# EAGLE design flight controller initial (EAGLE 9.3.2)
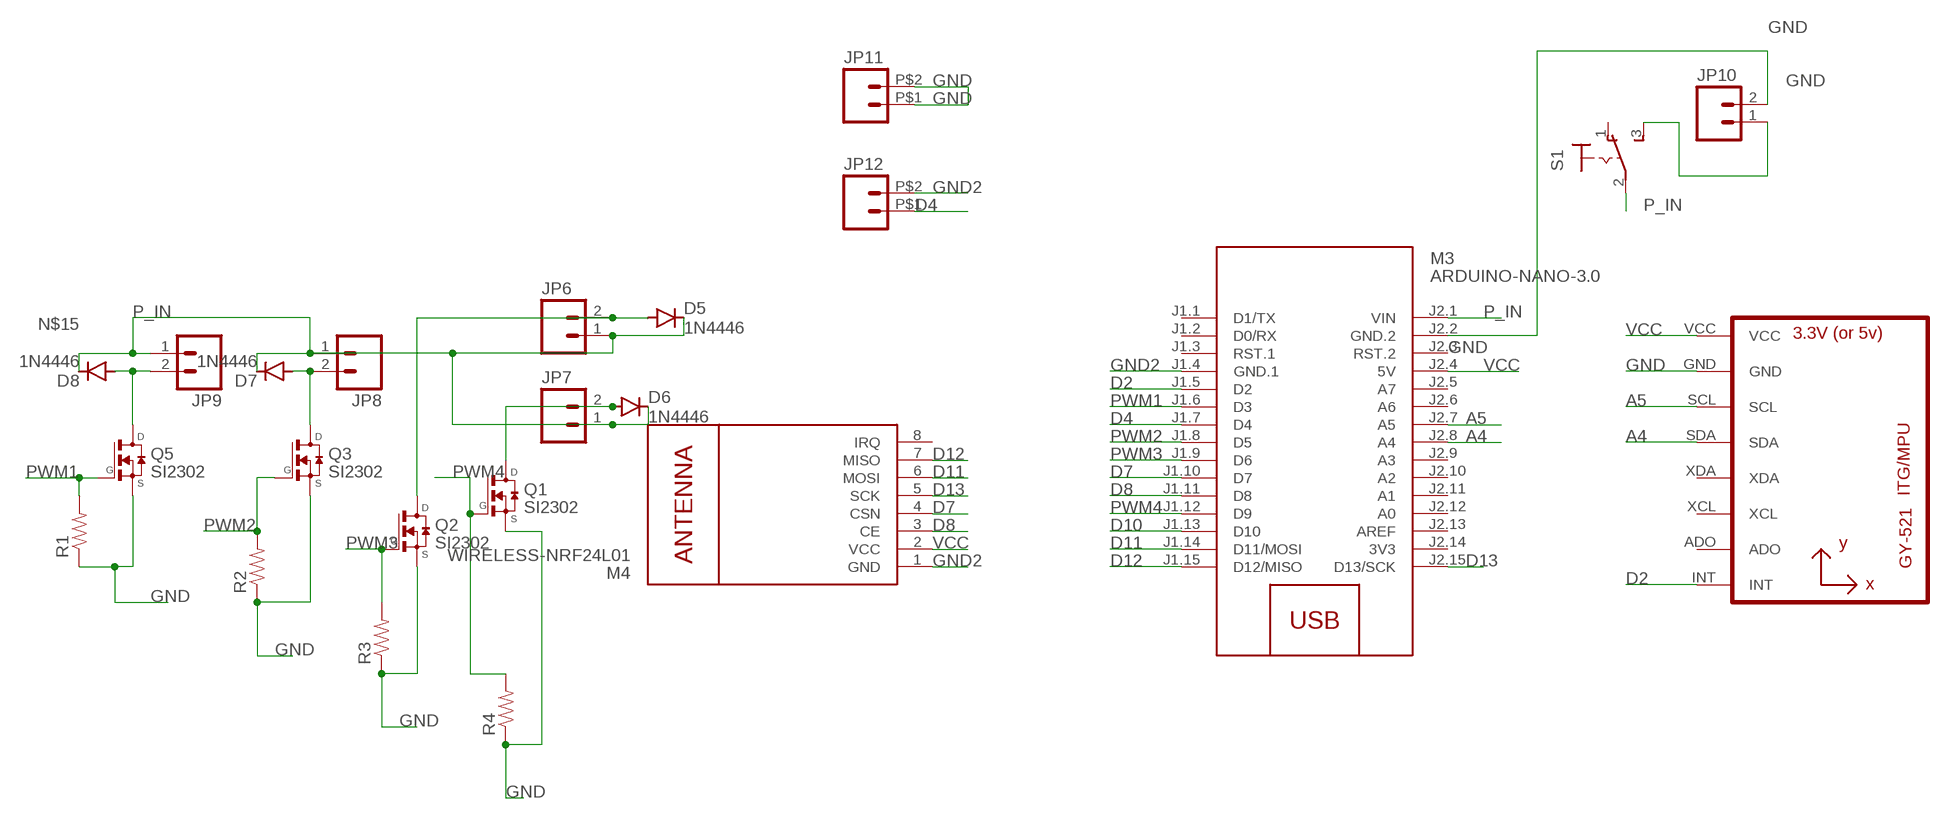
[diagram p0: schematic, sheet 1]

## Parts
D5  1N4446  [DO35-10]
D6  1N4446  [DO35-10]
D7  1N4446  [DO35-10]
D8  1N4446  [DO35-10]
JP6  M021X02_NO_SILK  [1X02_NO_SILK]
JP7  M021X02_NO_SILK  [1X02_NO_SILK]
JP8  M021X02_NO_SILK  [1X02_NO_SILK]
JP9  M021X02_NO_SILK  [1X02_NO_SILK]
JP10  M02PTH  [1X02]
JP11  M02PTH2  [1X02_BIG]
JP12  M02PTH2  [1X02_BIG]
M3  ARDUINO-NANO-3.0  [ARDUINO-NANO-3.0]
M4  WIRELESS-NRF24L01  [WIRELESS-NRF24L01]
Q1  SI2302  [SOT23]
Q2  SI2302  [SOT23]
Q3  SI2302  [SOT23]
Q5  SI2302  [SOT23]
R1  RESISTORAXIAL-0.3  [AXIAL-0.3]
R2  RESISTORAXIAL-0.3  [AXIAL-0.3]
R3  RESISTORAXIAL-0.3  [AXIAL-0.3]
R4  RESISTORAXIAL-0.3  [AXIAL-0.3]
S1  M9040P  [M9040P]
U2  GY-521MPU6050  [GY-521]

## Nets
A4: M3.J2.8(A4) U2.SDA
A5: M3.J2.7(A5) U2.SCL
D2: M3.J1.5(D2) U2.INT
D4: JP12.P$1 M3.J1.7(D4)
D7: M3.J1.10(D7) M4.4(CSN)
D8: M3.J1.11(D8) M4.3(CE)
D10: M3.J1.13(D10)
D11: M3.J1.14(D11/MOSI) M4.6(MOSI)
D12: M3.J1.15(D12/MISO) M4.7(MISO)
D13: M3.J2.15(D13/SCK) M4.5(SCK)
GND: JP10.2 JP11.P$1 JP11.P$2 M3.J2.2(GND.2) Q1.2(S) Q2.2(S) Q3.2(S) Q5.2(S) R1.P$1 R2.P$1 R3.P$1 R4.P$1 U2.GND
GND2: JP12.P$2 M3.J1.4(GND.1) M4.1(GND)
N$2: D6.A JP7.2 Q1.3(D)
N$15: D8.A JP9.2 Q5.3(D)
N$21: D5.A JP6.2 Q2.3(D)
N$24: D7.A JP8.2 Q3.3(D)
N$30: JP10.1 S1.3(S)
P_IN: D5.C D6.C D7.C D8.C JP6.1 JP7.1 JP8.1 JP9.1 M3.J2.1(VIN) S1.2(P)
PWM1: M3.J1.6(D3) Q5.1(G) R1.P$2
PWM2: M3.J1.8(D5) Q3.1(G) R2.P$2
PWM3: M3.J1.9(D6) Q2.1(G) R3.P$2
PWM4: M3.J1.12(D9) Q1.1(G) R4.P$2
VCC: M3.J2.4(5V) M4.2(VCC) U2.VCC
Unconnected: M3.J1.1(D1/TX) M3.J1.2(D0/RX) M3.J1.3(RST.1) M3.J2.3(RST.2) M3.J2.5(A7) M3.J2.6(A6) M3.J2.9(A3) M3.J2.10(A2) M3.J2.11(A1) M3.J2.12(A0) M3.J2.13(AREF) M4.8(IRQ) S1.1(O) U2.ADO U2.XCL U2.XDA

## Power pins joined to a net without a drawn wire
3V3: M3.J2.14(3V3)

## Library data of the parts
D5-D8 = diode:1N4446: DIODE high speed (Philips)
JP6-JP12 = SparkFun:M02: Header 2 Standard 2-pin 0.1" header. Use with straight break away headers (SKU : PRT-00116), right angle break away headers (PRT-00553), swiss pins (PRT-00743), machine pins (PRT-00117), and female headers (PRT-00115). Molex polarized connector foot print use with SKU : PRT-08233 with associated crimp pins and housings.
M3 = diy-modules:ARDUINO-NANO-3.0: Arduino Nano 3.0 and compatible devices More details available here: https://www.arduino.cc/en/Main/ArduinoBoardNano Click here to find device on ebay.com <http://www.ebay.com/sch/arduino+nano>
M4 = diy-modules:WIRELESS-NRF24L01: 2.4 GHz Wireless Module based on NRF24L01 chip More details available here: http://www.electrodragon.com/w/NRF24L01 Click here to find device on ebay.com <http://www.ebay.com/sch/nrf24l01+arduino>
Q1-Q3 Q5 = transistor-fet:SI2302: MOSFET N-Channel 20 V (D-S)
R1-R4 = SparkFun:RESISTOR: Resistor Basic schematic elements and footprints for 0603, 1206, and PTH resistors.
S1 = switch:M9040P: TOGGLE SWITCH Marquardt
U2 = gy-521:GY-521

## Board
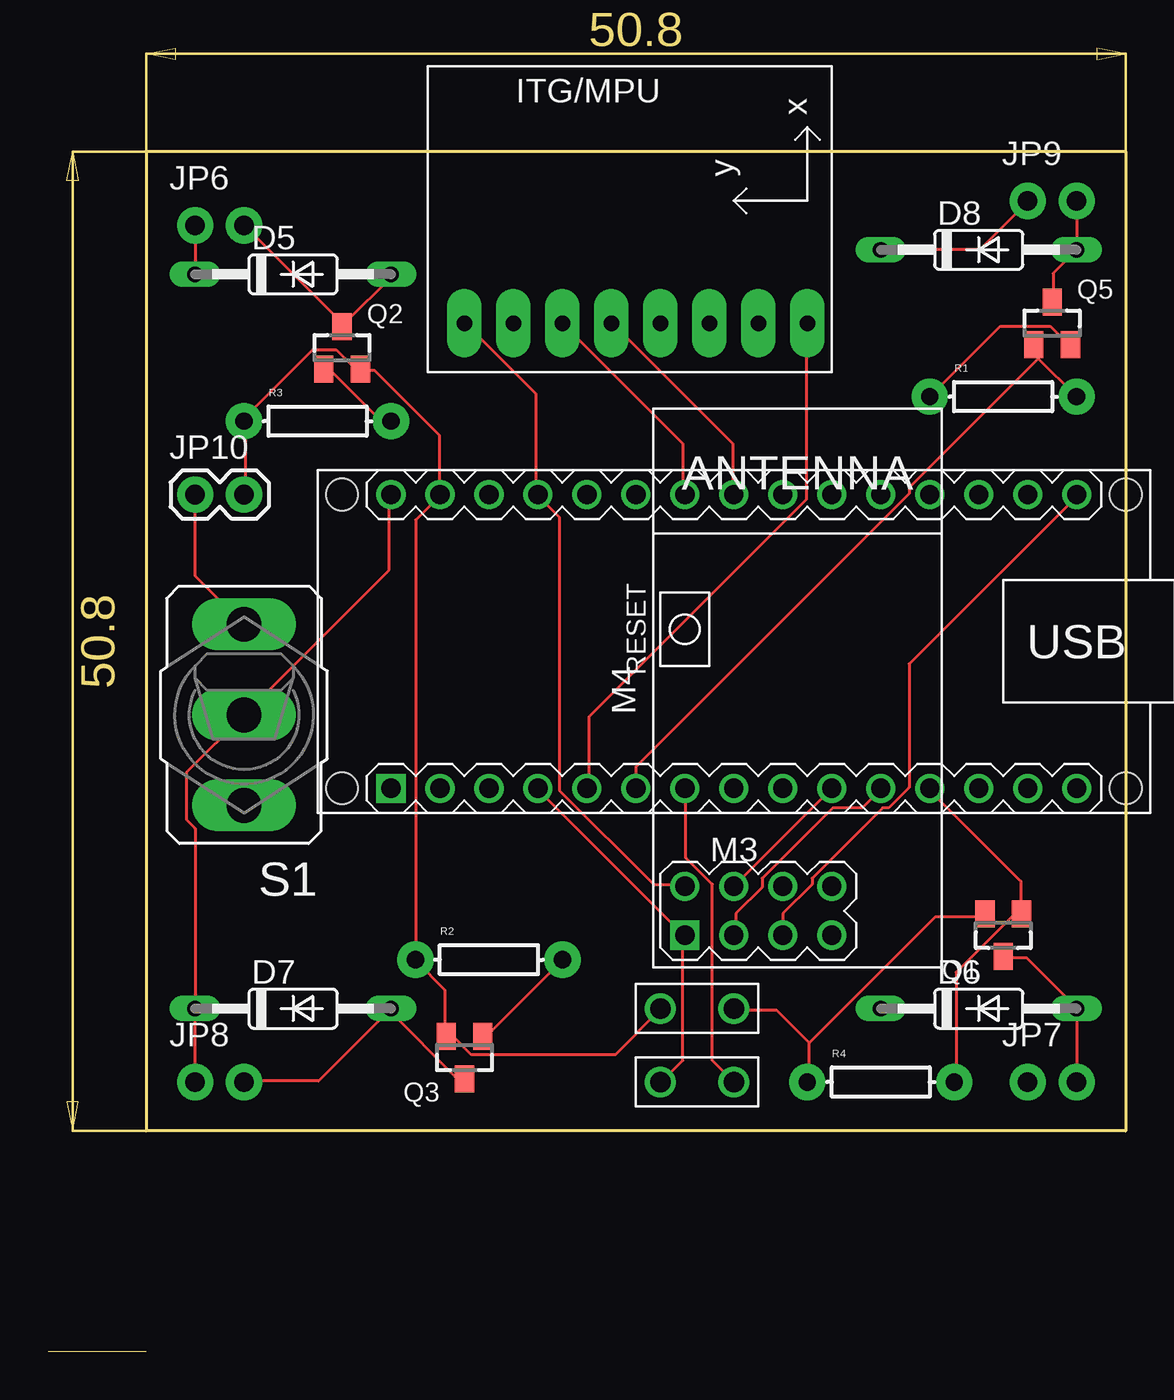
[diagram p1: board, top side]
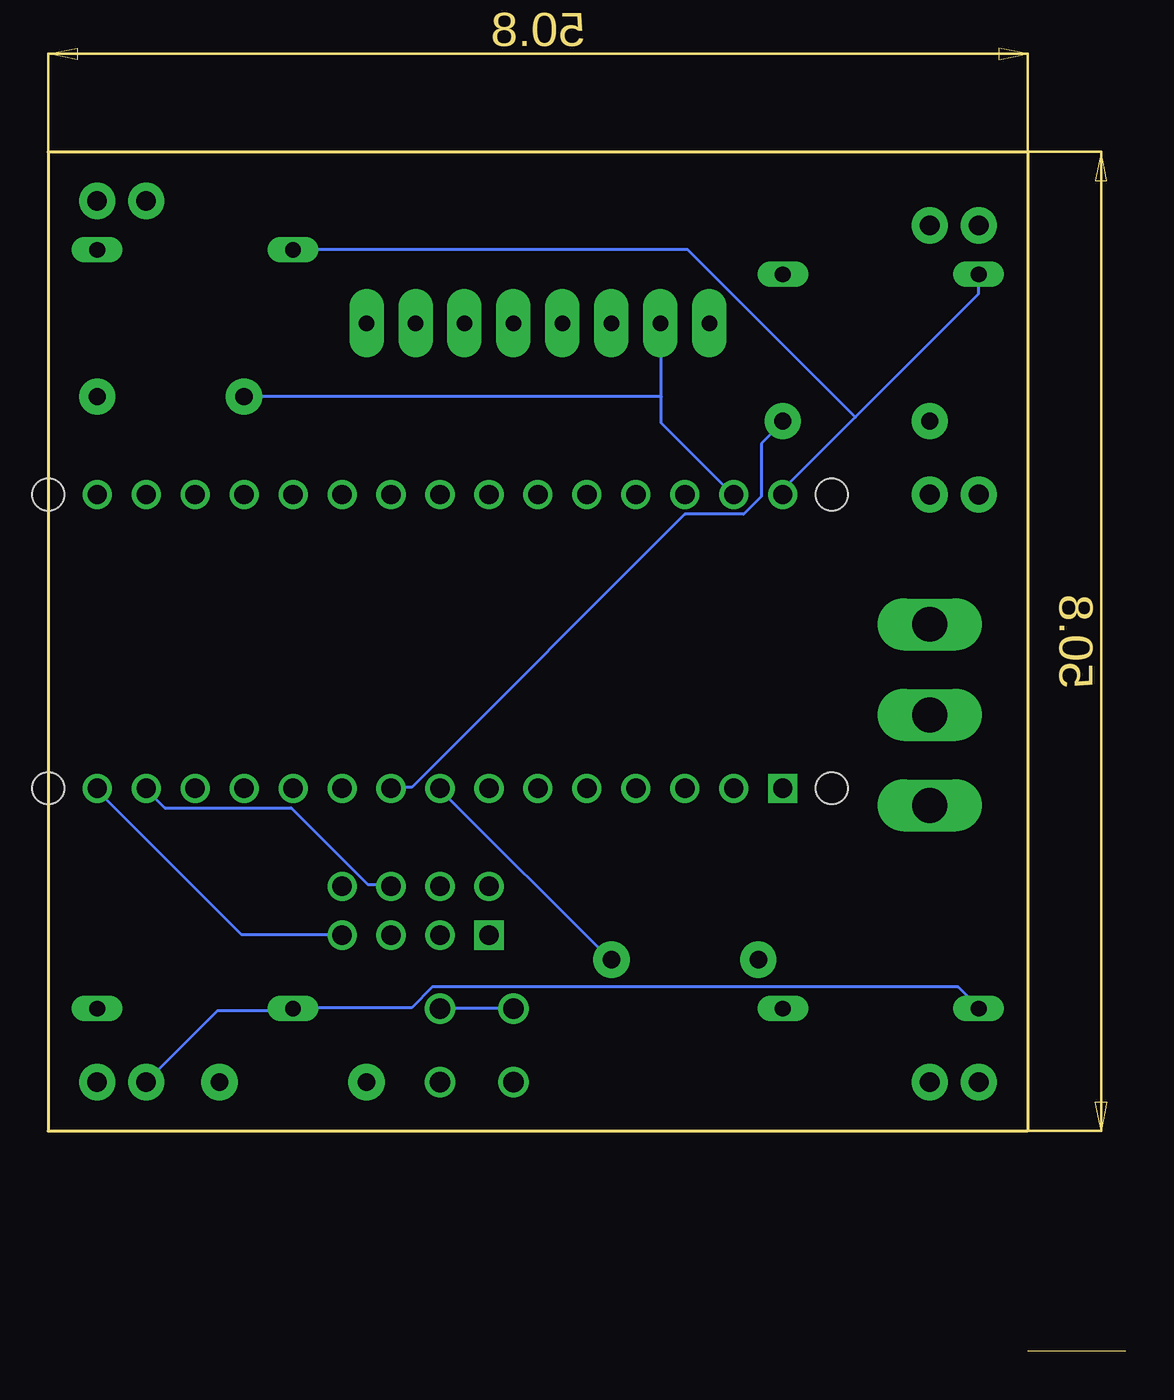
[diagram p2: board, bottom side, seen from below]

Size 55.88 x 62.23 mm. Coordinates in mm from the lower left corner, seen from the top.
Outline: 0,0 5.08,0
Outline: 5.08,62.23 5.08,11.43 55.88,11.43 55.88,62.23 5.08,62.23
Copper layers (1*16): Top 0.035mm / dielectric 1.5mm / Bottom 0.035mm
Design rules "default": minimum track width 6mil, minimum drill 0.35mm, track to track 6mil, track to pad 6mil, pad to pad 6mil, via to via 6mil, smd to smd 6mil, copper to edge 40mil, drill to drill 6mil, minimum pad ring 10mil, minimum via ring 8mil, stop-mask expansion 4mil, vias tented up to drill 0mil, thermal gap 10mil

### Footprints (pad centres in the part's own frame; a part is rotated, then mirrored left to right if it is on the bottom)
DO35-10 = drill 0.813 long: A 5.08,0; C -5.08,0
1X02_NO_SILK = drill 1.016 pad 1.88: 1 0,0; 2 2.54,0
1X02 = drill 1.016 pad 1.88: 1 0,0; 2 2.54,0
1X02_BIG = drill 1.067: P$1 0,0; P$2 3.81,0
ARDUINO-NANO-3.0 = drill 1 square: J1.1 17.78,7.62 | drill 1: J1.2 15.24,7.62; J1.3 12.7,7.62; J1.4 10.16,7.62; J1.5 7.62,7.62; J1.6 5.08,7.62; J1.7 2.54,7.62; J1.8 0,7.62; J1.9 -2.54,7.62; J1.10 -5.08,7.62; J1.11 -7.62,7.62; J1.12 -10.16,7.62; J1.13 -12.7,7.62; J1.14 -15.24,7.62; J1.15 -17.78,7.62; J2.1 17.78,-7.62; J2.2 15.24,-7.62; J2.3 12.7,-7.62; J2.4 10.16,-7.62; J2.5 7.62,-7.62; J2.6 5.08,-7.62; J2.7 2.54,-7.62; J2.8 0,-7.62; J2.9 -2.54,-7.62; J2.10 -5.08,-7.62; J2.11 -7.62,-7.62; J2.12 -10.16,-7.62; J2.13 -12.7,-7.62; J2.14 -15.24,-7.62; J2.15 -17.78,-7.62 | hole 1.651: -20.32,7.62; -20.32,-7.62; 20.32,-7.62; 20.32,7.62
WIRELESS-NRF24L01 = drill 1 square: 1 -12.7,6.35 | drill 1: 2 -10.16,6.35; 3 -12.7,3.81; 4 -10.16,3.81; 5 -12.7,1.27; 6 -10.16,1.27; 7 -12.7,-1.27; 8 -10.16,-1.27
SOT23 = smd 1 x 1.4: 1 -0.95,-1.1; 2 0.95,-1.1; 3 0,1.1
AXIAL-0.3 = drill 0.9 pad 1.88: P$1 -3.81,0; P$2 3.81,0
M9040P = drill 1.803 long: 1 0,4.699; 2 0,0; 3 0,-4.699
GY-521 = drill 0.8 pad 1.778 long: ADO -8.89,-6.35; GND -8.89,6.35; INT -8.89,-8.89; SCL -8.89,3.81; SDA -8.89,1.27; VCC -8.89,8.89; XCL -8.89,-3.81; XDA -8.89,-1.27

### Placement (x,y rotation side)
D5  12.7,55.88 0 top
D6  48.26,17.78 0 top
D7  12.7,17.78 0 top
D8  48.26,57.15 0 top
JP6  7.62,58.42 0 top
JP7  50.8,13.97 0 top
JP8  7.62,13.97 0 top
JP9  50.8,59.69 0 top
JP10  7.62,44.45 0 top
JP11  31.75,17.78 0 top
JP12  35.56,13.97 180 top
M3  35.56,36.83 180 top
M4  39.37,34.29 90 top
Q1  49.53,21.59 180 top
Q2  15.24,52.07 0 top
Q3  21.59,15.24 180 top
Q5  52.07,53.34 0 top
R1  49.53,49.53 0 top
R2  22.86,20.32 0 top
R3  13.97,48.26 0 top
R4  43.18,13.97 0 top
S1  10.16,33.02 180 top
U2  30.48,62.23 90 top

### Tracks (layer width: path | path; a pad name or v marks a point on that pad's centre or on a via)
A4
  Top 0.152: M3.J2.8 35.51,44.5 35.51,47.09 29.26,53.34 U2.SDA
A5
  Top 0.152: U2.SCL 32.92,47.09 32.92,44.5 M3.J2.7
D2
  Top 0.152: M3.J1.5 28.04,29.26 28.04,32.92 39.32,44.2 39.32,53.34 U2.INT
D4
  Top 0.152: JP12.P$1 34.44,15.09 34.44,24.23 33.07,25.6 33.07,29.11 M3.J1.7
D7
  Top 0.152: M3.J1.10 M4.4
D8
  Top 0.152: M4.3 35.66,21.64 35.66,22.71 37.03,24.08 37.03,24.54 40.69,28.19 42.22,28.19 43.13,29.11 M3.J1.11
D11
  Bottom 0.152: M4.6 38.1,24.23 39.32,24.23 43.28,28.19 49.84,28.19 50.75,29.11 M3.J1.14
D12
  Bottom 0.152: M4.7 40.69,21.64 45.87,21.64 53.34,29.11 M3.J1.15
D13
  Top 0.152: M4.5 38.1,22.71 39.62,24.23 39.62,24.54 43.28,28.19 43.59,28.19 44.65,29.26 44.65,35.66 53.34,44.35 M3.J2.15
GND
  Top 0.152: 39.47,16 46.02,22.55 48.46,22.55 Q1.2 | 39.47,16 39.47,14.02 R4.P$1 | 39.47,16 37.8,17.68 35.66,17.68 JP11.P$2 | JP11.P$1 31.7,17.68 29.41,15.39 21.95,15.39 21.03,16.31 20.73,16.31 Q3.2 20.57,16.46 20.57,18.75 19.05,20.27 R2.P$1 19.05,43.13 20.27,44.35 M3.J2.2 20.27,44.5 20.27,47.55 16.92,50.9 16.31,50.9 Q2.2 16.15,51.05 15.85,51.05 14.94,51.97 13.72,51.97 10.06,48.31 R3.P$1 10.21,48.16 10.21,44.5 JP10.2 | R1.P$1 49.38,53.19 51.97,53.19 52.88,52.27 Q5.2
  Bottom 0.152: JP11.P$1 31.85,17.83 35.51,17.83 JP11.P$2 | 24.08,49.53 24.08,48.16 20.42,44.5 M3.J2.2 | 24.08,49.53 24.08,53.34 U2.GND | 24.08,49.53 R1.P$1
GND2
  Top 0.152: JP12.P$2 31.85,14.02 32.92,15.09 32.92,21.49 M4.1 32.92,21.64 25.45,29.11 M3.J1.4
N$2
  Top 0.152: Q1.3 49.53,20.42 50.75,20.42 53.34,17.83 D6.A JP7.2
N$15
  Top 0.152: Q5.3 52.12,54.56 52.12,55.93 D8.A JP9.2
N$21
  Top 0.152: 15.39,53.34 17.83,55.78 D5.A | 15.39,53.34 15.24,53.19 Q2.3 15.39,53.34 | JP6.2 15.24,53.34 15.39,53.34
N$24
  Top 0.152: 17.68,17.68 21.18,14.17 21.49,14.17 Q3.3 | 17.68,17.68 14.02,14.02 10.21,14.02 JP8.2 | 17.68,17.68 D7.A
N$30
  Top 0.152: JP10.1 7.62,40.23 10.06,37.8 S1.3
P_IN
  Top 0.152: D8.C 48.31,57.15 50.75,59.59 JP9.1 | JP8.1 D7.C 7.62,27.13 7.16,27.58 7.16,30.02 S1.2 17.68,40.54 17.68,44.35 M3.J2.1 | JP6.1 D5.C
  Bottom 0.152: JP7.1 47.09,17.68 43.28,17.68 D6.C 43.13,17.83 37.03,17.83 35.97,18.9 8.69,18.9 7.62,17.83 D7.C | D5.C 7.62,54.86 14.02,48.46 | 14.02,48.46 17.68,44.81 17.68,44.5 M3.J2.1 | D8.C 22.71,57.15 14.02,48.46
PWM1
  Top 0.152: R1.P$2 51.36,51.51 | 51.36,51.51 51.21,51.66 51.21,52.12 Q5.1 | M3.J1.6 30.48,30.33 44.65,44.5 44.65,44.81 51.36,51.51
PWM2
  Top 0.152: Q3.1 22.55,16.46 22.86,16.46 26.67,20.27 R2.P$2
  Bottom 0.152: M3.J1.8 35.51,29.11 26.67,20.27 R2.P$2
PWM3
  Top 0.152: Q2.1 14.33,50.9 14.63,50.9 17.22,48.31 17.68,48.31 R3.P$2
  Bottom 0.152: M3.J1.9 38.1,29.26 37.03,29.26 22.86,43.43 19.81,43.43 18.9,44.35 18.9,47.09 17.83,48.16 R3.P$2
PWM4
  Top 0.152: M3.J1.12 45.72,29.11 50.44,24.38 50.44,22.71 Q1.1 50.44,22.55 49.99,22.55 47.09,19.66 47.09,14.02 R4.P$2
VCC
  Top 0.152: U2.VCC 21.64,53.34 25.3,49.68 25.3,44.5 M3.J2.4 25.45,44.35 26.52,43.28 26.52,29.11 31.39,24.23 32.92,24.23 M4.2